# Altium schematic sheet [6] Balancing.SchDoc
size A4
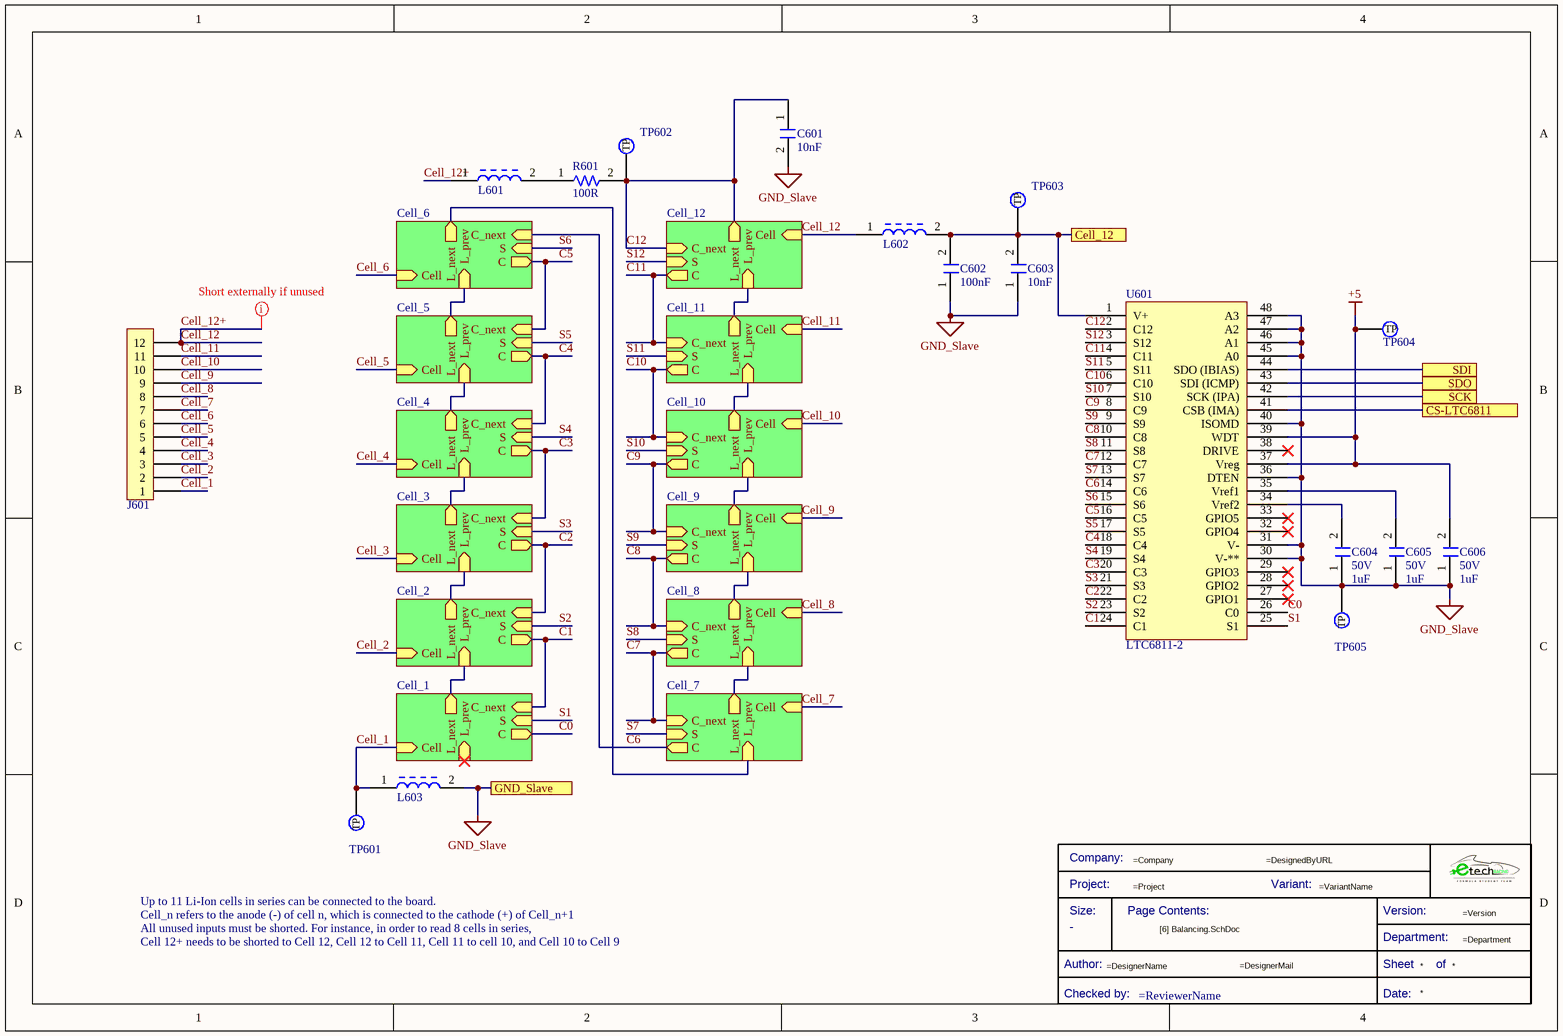
[diagram p0: [6] Balancing.SchDoc]

## Parts
*  Title Block_template  (value not drawn)  (graphical)
C601  Capacitance: 10nF  [C0805FNPC-R]  (hidden comment: 885012207092)
C602  Capacitance: 100nF  [C0805FNPC-R]  (hidden comment: 885012207098)
C603  Capacitance: 10nF  [C0805FNPC-R]  (hidden comment: 885012207092)
C604  Voltage Rating: 50V  Capacitance: 1uF  [C0805FNPC-R]  (hidden comment: 885012207103)
C605  Voltage Rating: 50V  Capacitance: 1uF  [C0805FNPC-R]  (hidden comment: 885012207103)
C606  Voltage Rating: 50V  Capacitance: 1uF  [C0805FNPC-R]  (hidden comment: 885012207103)
J601  61301211121  [J_Pinheader_1x12]  (value not drawn)
L601  782853561  [L_Ferrite_bead_0805]  (value not drawn)
L602  782853561  [L_Ferrite_bead_0805]  (value not drawn)
L603  782853561  [L_Ferrite_bead_0805]  (value not drawn)
R601  Resistance: 100R  [R0805FTK]  (hidden comment: CR0805-FX-1000ELF)
TP601  TestPoint  [TestPoint]  (value not drawn)  (no BOM)
TP602  TestPoint  [TestPoint]  (value not drawn)  (no BOM)
TP603  TestPoint  [TestPoint]  (value not drawn)  (no BOM)
TP604  TestPoint  [TestPoint]  (value not drawn)  (no BOM)
TP605  TestPoint  [TestPoint]  (value not drawn)  (no BOM)
U601  LTC6811-2  [U_LTC6811G-2]

## Sub-sheets
Cell_1 = [7] Cell_balancing: C (out), Cell (in), S (in), C_next (in), L_prev (in), L_next (out)
Cell_2 = [7] Cell_balancing: C (out), Cell (in), S (in), C_next (in), L_prev (in), L_next (out)
Cell_3 = [7] Cell_balancing: C (out), Cell (in), S (in), C_next (in), L_prev (in), L_next (out)
Cell_4 = [7] Cell_balancing: C (out), Cell (in), S (in), C_next (in), L_prev (in), L_next (out)
Cell_5 = [7] Cell_balancing: C (out), Cell (in), S (in), C_next (in), L_prev (in), L_next (out)
Cell_6 = [7] Cell_balancing: C (out), Cell (in), S (in), C_next (in), L_prev (in), L_next (out)
Cell_7 = [7] Cell_balancing: C (out), Cell (in), S (in), C_next (in), L_prev (in), L_next (out)
Cell_8 = [7] Cell_balancing: C (out), Cell (in), S (in), C_next (in), L_prev (in), L_next (out)
Cell_9 = [7] Cell_balancing: C (out), Cell (in), S (in), C_next (in), L_prev (in), L_next (out)
Cell_10 = [7] Cell_balancing: C (out), Cell (in), S (in), C_next (in), L_prev (in), L_next (out)
Cell_11 = [7] Cell_balancing: C (out), Cell (in), S (in), C_next (in), L_prev (in), L_next (out)
Cell_12 = [7] Cell_balancing: C (out), Cell (in), S (in), C_next (in), L_prev (in), L_next (out)

## Ports
Cell_12, CS-LTC6811, GND_Slave, SCK, SDI, SDO

## Nets
+5: C606.2 TP604.1(TP) U601.37(Vreg) U601.39(WDT)
GND_Slave: C601.2 C602.1 C603.1 C604.1 C605.1 C606.1 L603.2 TP605.1(TP) U601.30(V-**) U601.31(V-) U601.36(DTEN) U601.40(ISOMD) U601.45(A0) U601.46(A1) U601.47(A2) U601.48(A3) ; port GND_Slave
C0: U601.26(C0) ; sheet Cell_1/C
C1: U601.24(C1) ; sheet Cell_1/C_next, sheet Cell_2/C
C2: U601.22(C2) ; sheet Cell_2/C_next, sheet Cell_3/C
C3: U601.20(C3) ; sheet Cell_3/C_next, sheet Cell_4/C
C4: U601.18(C4) ; sheet Cell_4/C_next, sheet Cell_5/C
C5: U601.16(C5) ; sheet Cell_5/C_next, sheet Cell_6/C
C6: U601.14(C6) ; sheet Cell_6/C_next, sheet Cell_7/C
C7: U601.12(C7) ; sheet Cell_7/C_next, sheet Cell_8/C
C8: U601.10(C8) ; sheet Cell_8/C_next, sheet Cell_9/C
C9: U601.8(C9) ; sheet Cell_9/C_next, sheet Cell_10/C
C10: U601.6(C10) ; sheet Cell_10/C_next, sheet Cell_11/C
C11: U601.4(C11) ; sheet Cell_11/C_next, sheet Cell_12/C
C12: C601.1 R601.2 TP602.1(TP) U601.2(C12) ; sheet Cell_12/C_next, sheet Cell_12/L_next
Cell_1: J601.1 L603.1 TP601.1(TP) ; sheet Cell_1/Cell
Cell_2: J601.2 ; sheet Cell_2/Cell
Cell_3: J601.3 ; sheet Cell_3/Cell
Cell_4: J601.4 ; sheet Cell_4/Cell
Cell_5: J601.5 ; sheet Cell_5/Cell
Cell_6: J601.6 ; sheet Cell_6/Cell
Cell_7: J601.7 ; sheet Cell_7/Cell
Cell_8: J601.8 ; sheet Cell_8/Cell
Cell_9: J601.9 ; sheet Cell_9/Cell
Cell_10: J601.10 ; sheet Cell_10/Cell
Cell_11: J601.11 ; sheet Cell_11/Cell
Cell_12: C602.2 C603.2 L602.2 TP603.1(TP) U601.1(V+) ; port Cell_12
Cell_12: J601.12 L601.1 L602.1 ; sheet Cell_12/Cell  [also labelled Cell_12+]  [a separate net that carries the same name]
CS-LTC6811: U601.41(CSB_(IMA)) ; port CS-LTC6811
S1: U601.25(S1) ; sheet Cell_1/S
S2: U601.23(S2) ; sheet Cell_2/S
S3: U601.21(S3) ; sheet Cell_3/S
S4: U601.19(S4) ; sheet Cell_4/S
S5: U601.17(S5) ; sheet Cell_5/S
S6: U601.15(S6) ; sheet Cell_6/S
S7: U601.13(S7) ; sheet Cell_7/S
S8: U601.11(S8) ; sheet Cell_8/S
S9: U601.9(S9) ; sheet Cell_9/S
S10: U601.7(S10) ; sheet Cell_10/S
S11: U601.5(S11) ; sheet Cell_11/S
S12: U601.3(S12) ; sheet Cell_12/S
SCK: U601.42(SCK_(IPA)) ; port SCK
SDI: U601.44(SDO_(IBIAS)) ; port SDI
SDO: U601.43(SDI_(ICMP)) ; port SDO
NetC604_2: C604.2 U601.34(Vref2)
NetC605_2: C605.2 U601.35(Vref1)
NetL601_2: L601.2 R601.1
(unnamed): sheet Cell_1/L_next, sheet Cell_2/L_prev
(unnamed): sheet Cell_2/L_next, sheet Cell_3/L_prev
(unnamed): sheet Cell_3/L_next, sheet Cell_4/L_prev
(unnamed): sheet Cell_4/L_next, sheet Cell_5/L_prev
(unnamed): sheet Cell_5/L_next, sheet Cell_6/L_prev
(unnamed): sheet Cell_6/L_next, sheet Cell_7/L_prev
(unnamed): sheet Cell_7/L_next, sheet Cell_8/L_prev
(unnamed): sheet Cell_8/L_next, sheet Cell_9/L_prev
(unnamed): sheet Cell_9/L_next, sheet Cell_10/L_prev
(unnamed): sheet Cell_10/L_next, sheet Cell_11/L_prev
(unnamed): sheet Cell_11/L_next, sheet Cell_12/L_prev

Not connected (* = marked no-connect by the designer): U601 27(GPIO1)* 28(GPIO2)* 29(GPIO3)* 32(GPIO4)* 33(GPIO5)* 38(DRIVE)*

## Layout directives
mark named Short externally if unused: Cell_12

## Notes on the sheet
- Up to 11 Li-Ion cells in series can be connected to the board.
- Cell_n refers to the anode (-) of cell n, which is connected to the cathode (+) of Cell_n+1
- All unused inputs must be shorted. For instance, in order to read 8 cells in series,
- Cell 12+ needs to be shorted to Cell 12, Cell 12 to Cell 11, Cell 11 to cell 10, and Cell 10 to Cell 9
- Title
- Size:
- Date:
- A4
- Number:
- Time:
- Revision:
- Sheet
- of
- File:
- (in symbol Title Block_template) Company:; Project:; Variant:; Size:; Page Contents:; Version:; Department:; Author:; Sheet; of; Checked by:; Date:

## Library data of the parts
* = Title Block_template: Standard Title Block; Category: Title Block; Checked by:: =ReviewerName; Size: -
C601 C603 = C10n-50V-0805FNPC-X7R: Cap, 0.01ΜF, 50V, 10%, X7R, 0805; Manufacturer 1: Wurth Electronics; .Creator: DR; Supplier 1: RSComponents; Manufacturer Part Number 1: 885012207092; RoHS: Yes; Category: Ceramic Capacitors; Stock 1: 1; Pricing 1: 4000=0,03200, 12000=0,03100 (USD); Mount: Surface Mount; Case/Package: 0805; Case Code (Metric): 2012; Case Code (Imperial): 0805; Min Operating Temperature: -55°C; Max Operating Temperature: 125°C; Packaging: Cut Tape; Voltage Rating: 50V; Dielectric: X7R; Tolerance: 10%; Voltage Rating (DC): 50V; Length: 0.079inch; Width: 0.049inch; Thickness: 0.035inch; REACH SVHC: Unknown; RoHS Compliant: Yes; ComponentLink1URL: http://www.farnell.com/datasheets/1958497.pdf?src-supplier=Farnell; ComponentLink1Description: http://www.farnell.com/datasheets/1958497.pdf?src-supplier=Farnell; ComponentLink2URL: http://www.farnell.com/datasheets/1958497.pdf?src-supplier=Element14; ComponentLink2Description: http://www.farnell.com/datasheets/1958497.pdf?src-supplier=Element14; ComponentLink3URL: http://www.farnell.com/datasheets/1958497.pdf?src-supplier=Newark; ComponentLink3Description: http://www.farnell.com/datasheets/1958497.pdf?src-supplier=Newark; ComponentLink4URL: https://katalog.we-online.de/pbs/datasheet/885012207092.pdf?src-supplier=Digi-Key; ComponentLink4Description: https://katalog.we-online.de/pbs/datasheet/885012207092.pdf?src-supplier=Digi-Key; Supplier Part Number 1: 1813941
C602 = C100n-50V-0805FNPC-X7R: Cap, 0.1ΜF, 50V, 10%, X7R, 0805; Manufacturer 1: Wurth Electronics; .Creator: DR; Supplier 1: RSComponents; Manufacturer Part Number 1: 885012207098; RoHS: Yes; Category: Ceramic Capacitors; Stock 1: 8000; Pricing 1: 100=0,10200, 500=0,07100, 2000=0,06100 (GBP); Mount: Surface Mount; Case/Package: 0805; Case Code (Metric): 2012; Case Code (Imperial): 0805; Min Operating Temperature: -55°C; Max Operating Temperature: 125°C; Packaging: Cut Tape; Voltage Rating: 50V; Dielectric: X7R; Tolerance: 10%; Voltage Rating (DC): 50V; Length: 0.079inch; Width: 0.049inch; Thickness: 0.035inch; REACH SVHC: Unknown; RoHS Compliant: Yes; ComponentLink1URL: http://www.farnell.com/datasheets/1958498.pdf?src-supplier=Farnell; ComponentLink1Description: http://www.farnell.com/datasheets/1958498.pdf?src-supplier=Farnell; ComponentLink2URL: http://www.farnell.com/datasheets/1958498.pdf?src-supplier=Element14; ComponentLink2Description: http://www.farnell.com/datasheets/1958498.pdf?src-supplier=Element14; ComponentLink3URL: https://katalog.we-online.de/pbs/datasheet/885012207098.pdf?src-supplier=Digi-Key; ComponentLink3Description: https://katalog.we-online.de/pbs/datasheet/885012207098.pdf?src-supplier=Digi-Key; ComponentLink4URL: http://www.farnell.com/datasheets/1958498.pdf?src-supplier=Newark; ComponentLink4Description: http://www.farnell.com/datasheets/1958498.pdf?src-supplier=Newark; Supplier Part Number 1: 1813493
C604-C606 = C1u-50V-0805FNPC-X7R: Multilayer Ceramic Capacitor, Wcap-Csgp Series, 1 F, 10%, X7R, 50 V, 0805 [2012 Metric] Rohs Compliant: Yes; Manufacturer 1: Wurth Electronics; .Creator: GP; Supplier 1: RSComponents; Manufacturer Part Number 1: 885012207103; RoHS: Yes; Category: Ceramic Capacitors; Stock 1: 5100; Pricing 1: 50=0,27200, 250=0,25300, 500=0,22800, 1250=0,20100, 2500=0,17100 (GBP); Mount: Surface Mount; Case/Package: 0805; Case Code (Metric): 2012; Case Code (Imperial): 0805; Min Operating Temperature: -55°C; Max Operating Temperature: 85°C; Packaging: Cut Tape; Dielectric: X7R; Tolerance: 10%; Voltage Rating (DC): 50V; Length: 0.079inch; Width: 0.049inch; Thickness: 0.053inch; REACH SVHC: Unknown; RoHS Compliant: Yes; ComponentLink1URL: http://www.farnell.com/datasheets/1958501.pdf?src-supplier=Farnell; ComponentLink1Description: http://www.farnell.com/datasheets/1958501.pdf?src-supplier=Farnell; ComponentLink2URL: http://www.farnell.com/datasheets/1958501.pdf?src-supplier=Element14; ComponentLink2Description: http://www.farnell.com/datasheets/1958501.pdf?src-supplier=Element14; ComponentLink3URL: https://katalog.we-online.de/pbs/datasheet/885012107003.pdf?src-supplier=Digi-Key; ComponentLink3Description: https://katalog.we-online.de/pbs/datasheet/885012107003.pdf?src-supplier=Digi-Key; ComponentLink4URL: http://www.farnell.com/datasheets/1958501.pdf?src-supplier=Newark; ComponentLink4Description: http://www.farnell.com/datasheets/1958501.pdf?src-supplier=Newark; Supplier Part Number 1: 1813523
J601 = J_Pinheader_1x12: THT Vertical Pin Header WR-PHD, Pitch 2.54 mm, Single Row, 12 pins; Manufacturer 1: Wurth Electronics; Number of Positions: 12; Gender: Male; Connector Type: Male Pin; Pitch: 0.1inch; Supplier 1: Digi-Key; Manufacturer Part Number 1: 61301211121; RoHS: Yes; Category: Connectors; Stock 1: 2124; Pricing 1: 1=0,57000, 10=0,48400, 25=0,40400, 50=0,33700, 100=0,30600, 1000=0,27800 (USD); Mount: Through Hole; Contact Plating: Gold; Contact Material: Copper; Color: Black; Number of Rows: 1; Packaging: Bulk; Termination: Solder; Number of Contacts: 12; Contact Mating Length: 0.236inch; REACH SVHC: Unknown; RoHS Compliant: Yes; ComponentLink1URL: http://www.farnell.com/cad/1737268.pdf?src-supplier=Element14; ComponentLink1Description: http://www.farnell.com/cad/1737268.pdf?src-supplier=Element14; ComponentLink2URL: https://katalog.we-online.de/em/datasheet/6130xx11121.pdf?src-supplier=Digi-Key; ComponentLink2Description: https://katalog.we-online.de/em/datasheet/6130xx11121.pdf?src-supplier=Digi-Key
L601-L603 = L_Ferrite_bead_782853561: Manufacturer: Murata; Manufacturer Part Number: BLM18EG331TN1D; Material: Ferrite,Steel; Impedance: 330R; DC Resistance (DCR): 210mR; Tolerance: 25%; Current Rating: 500mA; Number of Lines: 1; Test Frequency: 100MHz; .Creator: GP; Supplier 1: Digi-Key; RoHS: Yes; Category: Ferrite Beads and Chips; Stock 1: 20037; Pricing 1: 1=0,23000, 10=0,17500, 25=0,14520, 50=0,12520, 100=0,11260, 250=0,09508, 500=0,08508, 1000=0,07257 (USD); Case/Package: 0603; Number of Pins: 2; Core Material: Ferrite; Case Code (Metric): 1608; Case Code (Imperial): 0603; Min Operating Temperature: -55°C; Max Operating Temperature: 125°C; Packaging: Tape and Reel; Max DC Current: 500mA; Number of Circuits: 1; Package Quantity: 1; Max Current Rating: 500mA; Termination: SMD/SMT; Series: BLM18E; Resistance: 210mR; Length: 1.6mm; Width: 0.8mm; Height: 0.8mm; Depth: 0.8mm; REACH SVHC: No SVHC; Lead Free: Lead Free; RoHS Compliant: Yes; ComponentLink1URL: https://datasheet.ciiva.com/1467/5169-1467232.pdf?src-supplier=Element14; ComponentLink1Description: https://datasheet.ciiva.com/1467/5169-1467232.pdf?src-supplier=Element14; ComponentLink2URL: https://datasheet.ciiva.com/11795/0900766b811b5866-11795405.pdf?src-supplier=RSComponents; ComponentLink2Description: https://datasheet.ciiva.com/11795/0900766b811b5866-11795405.pdf?src-supplier=RSComponents; ComponentLink3URL: https://datasheet.ciiva.com/41449/001172267-da-01-en-drossel-0603-330r-1-6x0-8mm-4000st-41449581.pdf?src-supplier=Conrad; ComponentLink3Description: https://datasheet.ciiva.com/41449/001172267-da-01-en-drossel-0603-330r-1-6x0-8mm-4000st-41449581.pdf?src-supplier=Conrad; ComponentLink4URL: https://datasheet.ciiva.com/1467/5169-1467233.pdf?src-supplier=Element14; ComponentLink4Description: https://datasheet.ciiva.com/1467/5169-1467233.pdf?src-supplier=Element14; ComponentLink5URL: https://datasheet.ciiva.com/1561/5169-1561345.pdf?src-supplier=Newark; ComponentLink5Description: https://datasheet.ciiva.com/1561/5169-1561345.pdf?src-supplier=Newark; ComponentLink6URL: https://datasheet.ciiva.com/3082/l0110s0101blm18e-3082714.pdf?src-supplier=Avnet; ComponentLink6Description: https://datasheet.ciiva.com/3082/l0110s0101blm18e-3082714.pdf?src-supplier=Avnet; ComponentLink7URL: https://datasheet.ciiva.com/6211/l0110s0101blm18e-6211470.pdf?src-supplier=Digi-Key; ComponentLink7Description: https://datasheet.ciiva.com/6211/l0110s0101blm18e-6211470.pdf?src-supplier=Digi-Key; ComponentLink8URL: https://datasheet.ciiva.com/6211/l0110s0101blm18e-6211471.pdf?src-supplier=Digi-Key; ComponentLink8Description: https://datasheet.ciiva.com/6211/l0110s0101blm18e-6211471.pdf?src-supplier=Digi-Key; Supplier Part Number 1: 490-5913-1-ND
R601 = R100-0805FTK: Res Thick Film 0805 100 Ohm 1% 1/8W ±100ppm/°C Molded SMD SMD Paper Tape on Plastic Reel; Manufacturer 1: Bourns; Power Rating: 125mW; Voltage Rating: 150V; .Creator: DR; Supplier 1: Arrow Electronics; Manufacturer Part Number 1: CR0805-FX-1000ELF; RoHS: Yes; Category: Chip SMD Resistors; Stock 1: 49802; Pricing 1: 1=0,05840, 10=0,03430, 25=0,01780, 100=0,00750, 250=0,00560, 500=0,00490, 3000=0,00470 (USD); Mount: Surface Mount; Case/Package: 0805; Number of Pins: 2; Contact Plating: Tin; Case Code (Imperial): 0805; Case Code (Metric): 2012; Min Operating Temperature: -55°C; Max Operating Temperature: 155°C; Tolerance: 1%; Resistor Type: Thick Film; Temperature Coefficient: 100ppm/°C; Packaging: Tape and Reel; Package Quantity: 1; Termination: SMD/SMT; Number of Terminations: 2; Max Power Dissipation: 125mW; Voltage Rating (DC): 150V; Features: Moisture Resistant; Series: CR0805; Resistance Tolerance: 1%; Construction: Rectangular; Technology: THICK FILM; Length: 2mm; Width: 1.25mm; Height: 0.5mm; Depth: 1.25mm; Thickness: 508um; Radiation Hardening: No; REACH SVHC: No SVHC; Military Standard: Not; RoHS Compliant: Yes; ComponentLink1URL: https://datasheet.ciiva.com/11809/0900766b80fcdb72-11809178.pdf?src-supplier=RSComponents; ComponentLink1Description: https://datasheet.ciiva.com/11809/0900766b80fcdb72-11809178.pdf?src-supplier=RSComponents; ComponentLink2URL: https://datasheet.ciiva.com/6547/chpreztr-6547413.pdf?src-supplier=Digi-Key; ComponentLink2Description: https://datasheet.ciiva.com/6547/chpreztr-6547413.pdf?src-supplier=Digi-Key; ComponentLink3URL: https://datasheet.ciiva.com/6547/chpreztr-6547414.pdf?src-supplier=Digi-Key; ComponentLink3Description: https://datasheet.ciiva.com/6547/chpreztr-6547414.pdf?src-supplier=Digi-Key; ComponentLink4URL: https://datasheet.ciiva.com/6547/chpreztr-6547415.pdf?src-supplier=Digi-Key; ComponentLink4Description: https://datasheet.ciiva.com/6547/chpreztr-6547415.pdf?src-supplier=Digi-Key; ComponentLink5URL: https://datasheet.ciiva.com/9120/chpreztr-9120744.pdf?src-supplier=Avnet; ComponentLink5Description: https://datasheet.ciiva.com/9120/chpreztr-9120744.pdf?src-supplier=Avnet; Supplier Part Number 1: CR0805-FX-1000ELF
TP601-TP605 = TestPoint: Test Point 1x1 mm; .Creator: GP; Category: TestPoint; .PCBcheck: GP; .SCHcheck: GP
U601 = U_LTC6811-2: Sc-Automotive Multicell Battery Stack Monitor With Addressable Isospi Interface; Manufacturer 1: Analog Devices; .Creator: GP; ComponentLink1URL: https://www.analog.com/media/en/technical-documentation/data-sheets/ltc6811-1-6811-2.pdf; ComponentLink1Description: Datasheet; ComponentLink2Description: Where buy it; ComponentLink2URL: https://www.mouser.es/ProductDetail/Analog-Devices/LTC6811IG-23ZZTRPBF?qs=byeeYqUIh0NWJgxDt7RX5g%3D%3D; Supplier 1: Digi-Key; Category: Battery Management; Pricing 1: 1=21,46000, 10=19,72200, 25=18,90400, 100=16,65600, 250=15,90600 (USD); RoHS Compliant: Yes; ComponentLink3URL: http://www.linear.com/docs/55980?src-supplier=Digi-Key; ComponentLink3Description: http://www.linear.com/docs/55980?src-supplier=Digi-Key; ComponentLink4URL: https://datasheet.octopart.com/LTC6811HG-1%23PBF-Analog-Devices-datasheet-138896417.pdf?src-supplier=Upverter; ComponentLink4Description: https://datasheet.octopart.com/LTC6811HG-1%23PBF-Analog-Devices-datasheet-138896417.pdf?src-supplier=Upverter; ComponentLink5URL: https://datasheet.octopart.com/LTC6811HG-1%23PBF-Linear-Technology-datasheet-66874450.pdf?src-supplier=Linear+Technology; ComponentLink5Description: https://datasheet.octopart.com/LTC6811HG-1%23PBF-Linear-Technology-datasheet-66874450.pdf?src-supplier=Linear+Technology; ComponentLink6URL: https://sigma.octopart.com/57702806/technical_drawing/Linear-Technology-LTC6811HG-1%23PBF.pdf?src-supplier=Linear+Technology; ComponentLink6Description: https://sigma.octopart.com/57702806/technical_drawing/Linear-Technology-LTC6811HG-1%23PBF.pdf?src-supplier=Linear+Technology; Supplier Part Number 1: 505-LTC6811HG-1#PBF-ND; Case/Package: SSOP; Manufacturer Part Number 1: LTC6811-2